# Altium schematic sheet dv_mcu_pwr.SchDoc: =GlobalProjectName
size 209 x 297 mm; ApprovedBy: Утвердил; CheckedBy: Проверил; Author: Разработал; SheetNumber: 6; SheetTotal: 6; PageSetup: Record=PageOptions|CenterHorizontal=True|CenterVertical=True|PrintScale=1.00|XCorrection=1.00|YCorrection=1.00|PrintKind=1|BorderSize=5000000|LeftOffset=0|BottomOffset=0|Orientation=2|PaperLength=1000|PaperWidth=1000|Scale=100|PaperSource=15|PrintQuality=1200|MediaType=1|DitherType=10|PaperKind=A3|PrintScaleMode=1; Weight: -; ScaleFactor: -; NormInspection: Норм.Контр.
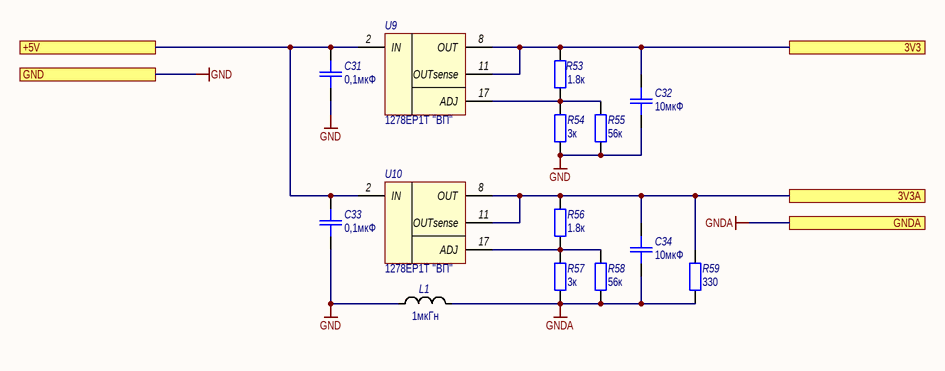
[diagram p0: dv_mcu_pwr.SchDoc]

## Parts
C31  value 0,1мкФ  [SMD_C0805]  (hidden comment: K10-79)
C32  value 10мкФ  [SMD_C0805]  (hidden comment: K10-79)
C33  value 0,1мкФ  [SMD_C0805]  (hidden comment: K10-79)
C34  value 10мкФ  [SMD_C0805]  (hidden comment: K10-79)
L1  1мкГн  [SMD_0805]
R53  value 1.8к  [SMD_0805]  (hidden comment: OSM R1-12)
R54  value 3к  [SMD_0805]  (hidden comment: OSM R1-12)
R55  value 56к  [SMD_0805]  (hidden comment: OSM R1-12)
R56  value 1.8к  [SMD_0805]  (hidden comment: OSM R1-12)
R57  value 3к  [SMD_0805]  (hidden comment: OSM R1-12)
R58  value 56к  [SMD_0805]  (hidden comment: OSM R1-12)
R59  value 330  [SMD_0805]  (hidden comment: OSM R1-12)
U9  Наименование: 1278ЕР1Т "ВП"  [4116.4-3_offcut]  (hidden comment: 1278ER1T VP)
U10  Наименование: 1278ЕР1Т "ВП"  [4116.4-3_offcut]  (hidden comment: 1278ER1T VP)

## Ports
3V3, 3V3A, +5V, GND, GNDA

## Nets
GND: C31.1 C32.1 C33.1 L1.1 R54.1 R55.1 ; port GND
GNDA: C34.1 L1.2 R57.1 R58.1 R59.1 ; port GNDA
3V3: C32.2 R53.2 U9.8(OUT) U9.11(OUTsense) ; port 3V3
3V3A: C34.2 R56.2 R59.2 U10.8(OUT) U10.11(OUTsense) ; port 3V3A
+5V: C31.2 C33.2 U9.2(IN) U10.2(IN) ; port +5V
NetR53_1: R53.1 R54.2 R55.2 U9.17(ADJ)
NetR56_1: R56.1 R57.2 R58.2 U10.17(ADJ)

## Notes on the sheet
- Подп. и дата
- Инв. № дубл.
- Взам. инв. №
- Инв. № подл.
- Изм.
- Лист
- № докум.
- Подп.
- Дата
- Форма 2а ГОСТ 2.104-2006
- Копировал
- Формат А4

## Library data of the parts
C31-C34 = Capacitor: Назначение: SMD-конденсатор; Наименование: К10-79; Потребление, Вт: 0; Напряжение: В; Точность: %
L1 = Inductor: Наименование: Индуктивность; Назначение: SMD-индуктивность; Потребление, Вт: 0,010; Value: 1мкГн
R53-R59 = Resistor: Наименование: ОСМ Р1-12; Назначение: SMD-резистор; Потребление, Вт: 0,001; Точность: %
U9 U10 = 1278ER1T: Low-drop linear regulator; Назначение: Линейный регулятор; Потребление, Вт: 0,100; ComponentLink1Description: DataSheet; ComponentLink1URL: https://www.radiant.su/files/images/Kremhij-marketing/1278EP1T.pdf